# Altium schematic sheet stm.SchDoc: =GlobalProjectName
size 209 x 297 mm; ApprovedBy: Утвердил; CheckedBy: Проверил; Author: Разработал; SheetNumber: 5; SheetTotal: 8; PageSetup: Record=PageOptions|CenterHorizontal=True|CenterVertical=True|PrintScale=1.00|XCorrection=1.00|YCorrection=1.00|PrintKind=1|BorderSize=5000000|LeftOffset=0|BottomOffset=0|Orientation=2|PaperLength=1000|PaperWidth=1000|Scale=100|PaperSource=15|PrintQuality=1200|MediaType=1|DitherType=10|PaperKind=A3|PrintScaleMode=1; Weight: -; ScaleFactor: -; NormInspection: Норм.Контр.
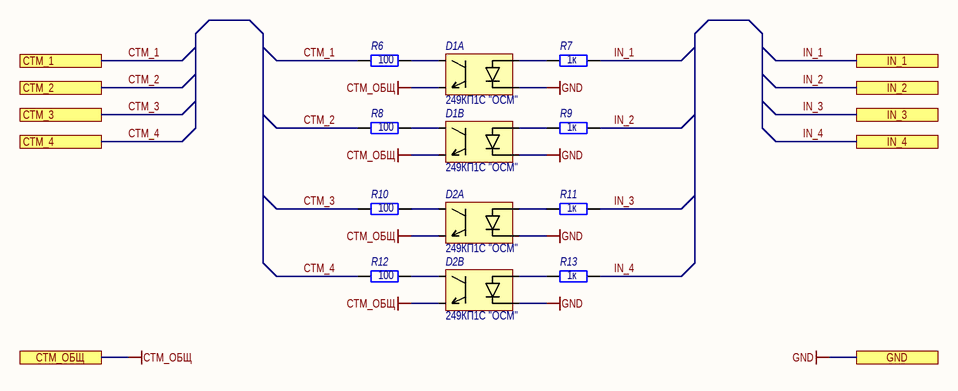
[diagram p0: stm.SchDoc]

## Parts
D1  Наименование: 249КП1C "ОСМ"  [401.14-4]  (hidden comment: 249KP1S OSM)  (parts A,B of 2)
D2  Наименование: 249КП1C "ОСМ"  [401.14-4]  (hidden comment: 249KP1S OSM)  (parts A,B of 2)
R6  100  [SMD_0805]
R7  1к  [SMD_0805]
R8  100  [SMD_0805]
R9  1к  [SMD_0805]
R10  100  [SMD_0805]
R11  1к  [SMD_0805]
R12  100  [SMD_0805]
R13  1к  [SMD_0805]

## Ports
GND, IN_1, IN_2, IN_3, IN_4, СТМ_1, СТМ_2, СТМ_3, СТМ_4, СТМ_ОБЩ

## Nets
GND: D1.3 D1.10 D2.3 D2.10 ; port GND
СТМ_ОБЩ: D1.6 D1.13 D2.6 D2.13 ; port СТМ_ОБЩ
IN_1: R7.2 ; port IN_1
IN_2: R9.2 ; port IN_2
IN_3: R11.2 ; port IN_3
IN_4: R13.2 ; port IN_4
СТМ_1: R6.1 ; port СТМ_1
СТМ_2: R8.1 ; port СТМ_2
СТМ_3: R10.1 ; port СТМ_3
СТМ_4: R12.1 ; port СТМ_4
NetD1_2: D1.2 R7.1
NetD1_4: D1.4 R8.2
NetD1_9: D1.9 R9.1
NetD1_11: D1.11 R6.2
NetD2_2: D2.2 R11.1
NetD2_4: D2.4 R12.2
NetD2_9: D2.9 R13.1
NetD2_11: D2.11 R10.2

## Notes on the sheet
- Подп. и дата
- Инв. № дубл.
- Взам. инв. №
- Инв. № подл.
- Изм.
- Лист
- № докум.
- Подп.
- Дата
- Форма 2а ГОСТ 2.104-2006
- Копировал
- Формат А4

## Library data of the parts
D1 D2 = 249KP1: Транзисторная оптопара; Потребление, Вт: 0,005; Назначение: Оптопара; ComponentLink1Description: DataSheet; ComponentLink1URL: https://eandc.ru/pdf/mikroskhema/249kp1.pdf
R6-R13 = Resistor: Наименование: Р1-12-0.125 ОСМ; Назначение: SMD-резистор; Потребление, Вт: 0,001
  R6 R8 R10 R12: Value: 100
  R7 R9 R11 R13: Value: 1к